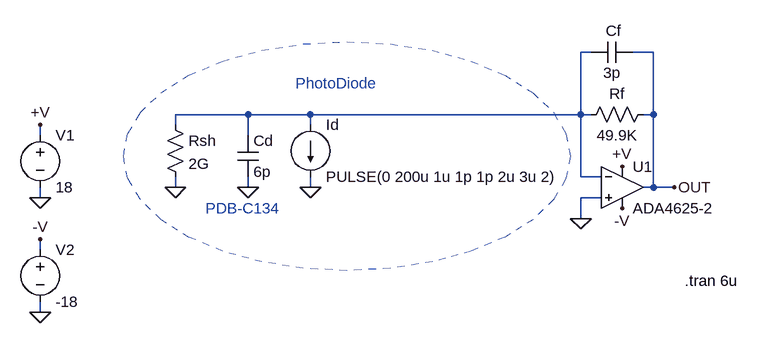
[diagram p0: schematic ADA4625-2.asc]
ADA4625-2.asc, the LTspice schematic file:
Version 4
SHEET 1 4472 1028
WIRE -2368 -608 -2384 -608
WIRE -2272 -608 -2304 -608
WIRE -2896 -512 -3008 -512
WIRE -2800 -512 -2896 -512
WIRE -2384 -512 -2384 -608
WIRE -2384 -512 -2800 -512
WIRE -2368 -512 -2384 -512
WIRE -2272 -512 -2272 -608
WIRE -2272 -512 -2288 -512
WIRE -3008 -496 -3008 -512
WIRE -2800 -496 -2800 -512
WIRE -3216 -480 -3216 -496
WIRE -2896 -480 -2896 -512
WIRE -2384 -416 -2384 -512
WIRE -2352 -416 -2384 -416
WIRE -3008 -400 -3008 -416
WIRE -2896 -400 -2896 -416
WIRE -2800 -400 -2800 -416
WIRE -2272 -400 -2272 -512
WIRE -2272 -400 -2288 -400
WIRE -2240 -400 -2272 -400
WIRE -3216 -384 -3216 -400
WIRE -2352 -384 -2384 -384
WIRE -2384 -352 -2384 -384
WIRE -3216 -304 -3216 -320
WIRE -3216 -208 -3216 -224
FLAG -3216 -384 0
FLAG -3216 -496 +V
FLAG -2240 -400 OUT
FLAG -2320 -432 +V
FLAG -2384 -352 0
FLAG -2320 -368 -V
FLAG -2800 -400 0
FLAG -2896 -400 0
FLAG -3008 -400 0
FLAG -3216 -208 0
FLAG -3216 -320 -V
SYMBOL voltage -3216 -496 R0
WINDOW 123 0 0 Left 2
WINDOW 39 0 0 Left 2
SYMATTR InstName V1
SYMATTR Value 18
SYMBOL res -2272 -528 R90
WINDOW 0 0 56 VBottom 2
WINDOW 3 32 56 VTop 2
SYMATTR InstName Rf
SYMATTR Value 49.9K
SYMBOL current -2800 -496 R0
WINDOW 123 24 116 Left 2
WINDOW 39 24 98 Left 2
SYMATTR Value PULSE(0 200u 1u 1p 1p 2u 3u 2)
SYMATTR InstName Id
SYMBOL cap -2304 -624 R90
WINDOW 0 -1 29 VBottom 2
WINDOW 3 32 32 VTop 2
SYMATTR InstName Cf
SYMATTR Value 3p
SYMBOL cap -2912 -480 R0
SYMATTR InstName Cd
SYMATTR Value 6p
SYMBOL res -3024 -512 R0
SYMATTR InstName Rsh
SYMATTR Value 2G
SYMBOL opamps\\ADA4625-2 -2320 -464 R0
SYMATTR InstName U1
SYMBOL voltage -3216 -320 R0
WINDOW 123 0 0 Left 2
WINDOW 39 0 0 Left 2
SYMATTR InstName V2
SYMATTR Value -18
TEXT -2760 -560 Center 2 ;PhotoDiode
TEXT -2904 -368 Center 2 ;PDB-C134
TEXT -2224 -256 Left 2 !.tran 6u
CIRCLE Normal -2400 -272 -3088 -624 2

The netlist it stands for:
* ADA4625-2.asc
V1 +V 0 18
Rf OUT N001 49.9K
Id N001 0 PULSE(0 200u 1u 1p 1p 2u 3u 2)
Cf OUT N001 3p
Cd N001 0 6p
Rsh N001 0 2G
XU1 0 N001 +V -V OUT ADA4625-2  ; pins In+ In- V+ V- OUT
V2 -V 0 -18
* PhotoDiode
* PDB-C134
.tran 6u
.backanno
.end